# Altium project TP1 EJ1 Notch.PrjPcb
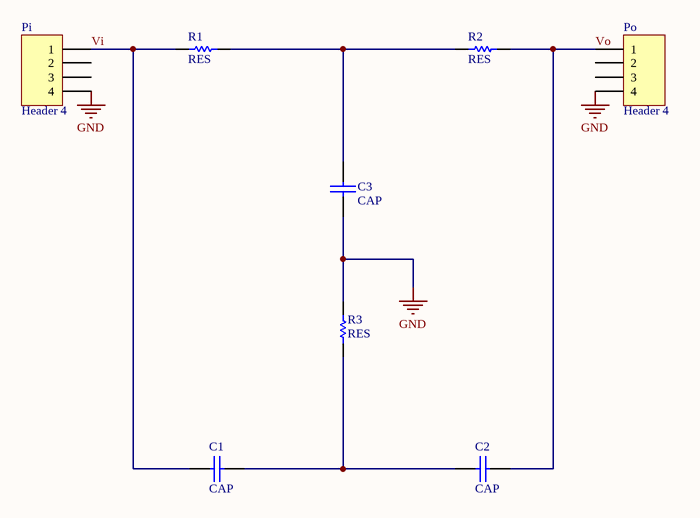
[diagram p0: Sheet1.SchDoc]
1 sheet, 8 parts. Net scope: global (net labels, ports and power ports of the same name join across sheets).
Board file: PCB1.PcbDoc

## Sheet Sheet1.SchDoc
size A4

### Parts
C1  CAP  [CAP100]
C2  CAP  [CAP100]
C3  CAP  [CAP100]
Pi  Header 4  [HDR1X4]
Po  Header 4  [HDR1X4]
R1  RES  [RES400]
R2  RES  [RES400]
R3  RES  [RES400]

### Nets
GND: C3.2 Pi.4 Po.4 R3.2
Vi: C1.1 Pi.1 R1.1
Vo: C2.2 Po.1 R2.2
NetC1_2: C1.2 C2.1 R3.1
NetC3_1: C3.1 R1.2 R2.1

Not connected (* = marked no-connect by the designer): Pi 2 3; Po 2 3

### Library data of the parts
Pi Po = Header 4: Header, 4-Pin; LatestRevisionDate: 17-Jul-2002; LatestRevisionNote: Re-released for DXP Platform.; Publisher: Altium Limited